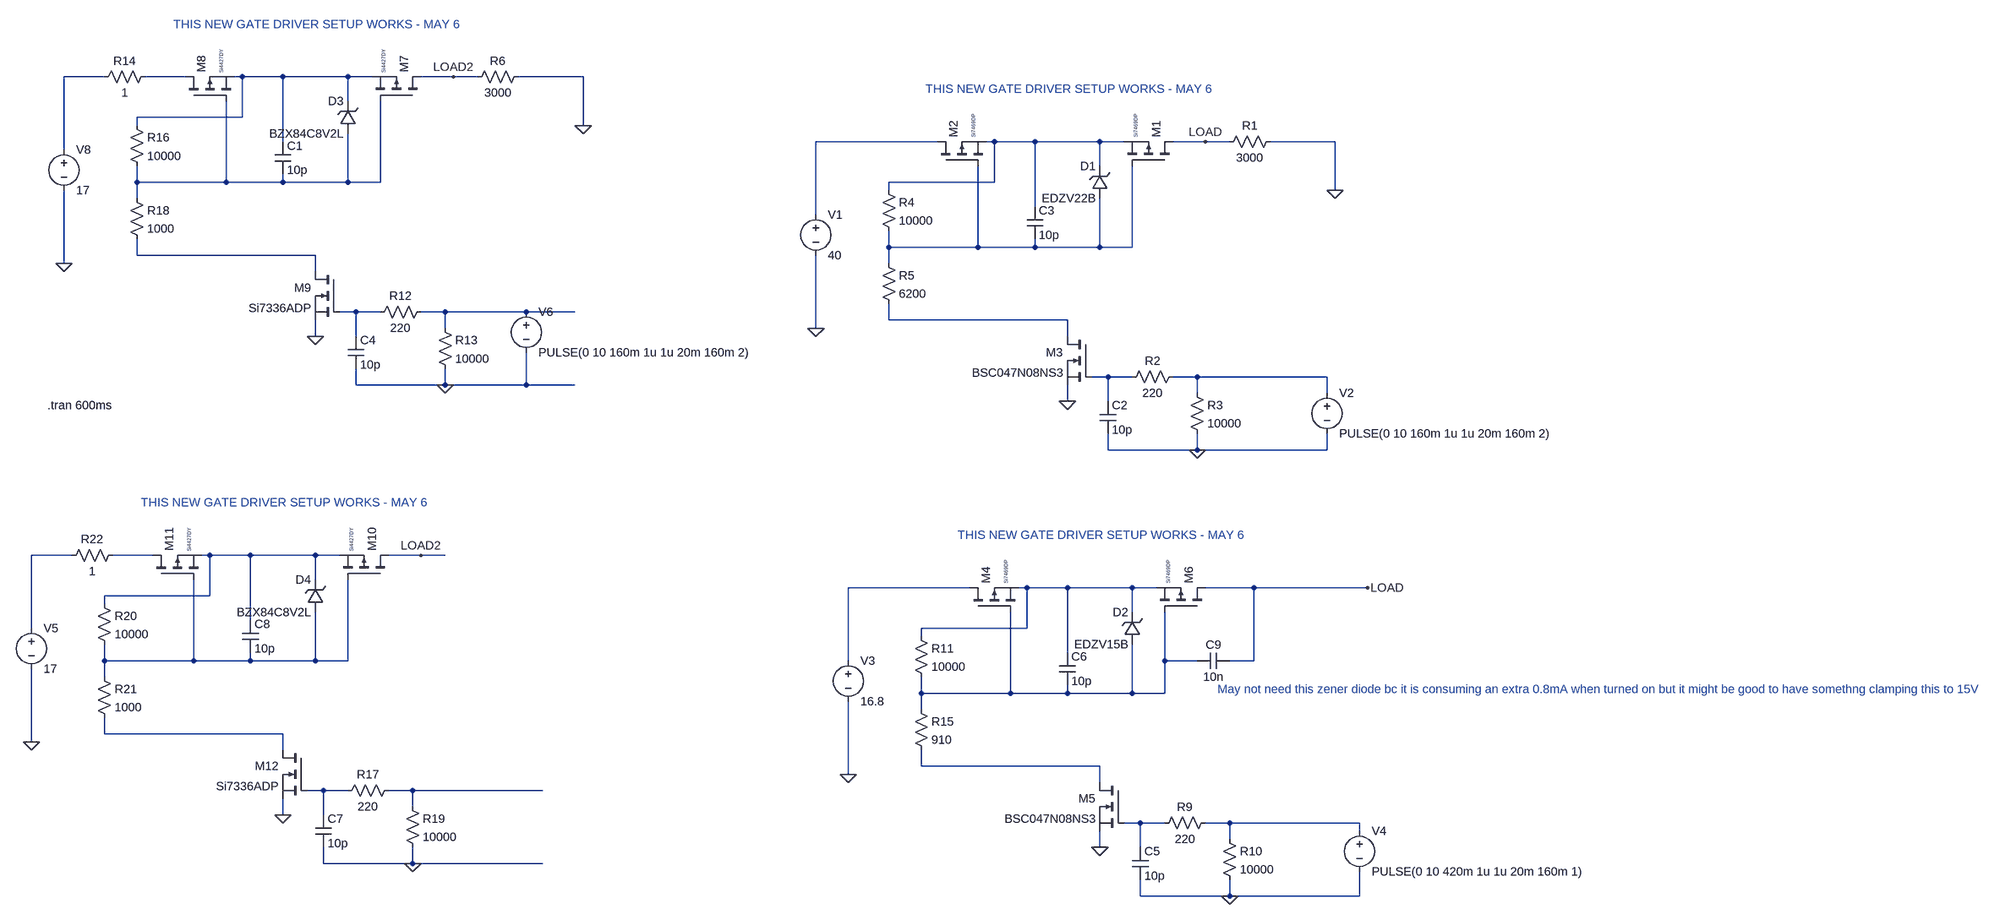
[diagram p0: schematic PMOS Bidirectional Switch.asc]
PMOS Bidirectional Switch.asc, the LTspice schematic file:
Version 4.1
SHEET 1 3412 2516
WIRE -672 256 -752 256
WIRE -512 256 -592 256
WIRE -400 256 -416 256
WIRE -320 256 -400 256
WIRE -192 256 -320 256
WIRE -144 256 -192 256
WIRE 16 256 -48 256
WIRE 64 256 16 256
WIRE 272 256 144 256
WIRE -192 304 -192 256
WIRE -400 336 -400 256
WIRE -400 336 -608 336
WIRE -608 352 -608 336
WIRE 272 352 272 256
WIRE -320 384 -320 256
WIRE 1216 384 976 384
WIRE 1328 384 1312 384
WIRE 1408 384 1328 384
WIRE 1536 384 1408 384
WIRE 1584 384 1536 384
WIRE 1744 384 1680 384
WIRE 1792 384 1744 384
WIRE 2000 384 1872 384
WIRE -752 400 -752 256
WIRE 1536 432 1536 384
WIRE -608 464 -608 432
WIRE -432 464 -432 304
WIRE -432 464 -608 464
WIRE -320 464 -320 448
WIRE -320 464 -432 464
WIRE -192 464 -192 368
WIRE -192 464 -320 464
WIRE -128 464 -128 304
WIRE -128 464 -192 464
WIRE 1328 464 1328 384
WIRE 1328 464 1120 464
WIRE 1120 480 1120 464
WIRE 2000 480 2000 384
WIRE -608 496 -608 464
WIRE 1408 512 1408 384
WIRE 976 528 976 384
WIRE 1120 592 1120 560
WIRE 1296 592 1296 432
WIRE 1296 592 1120 592
WIRE 1408 592 1408 576
WIRE 1408 592 1296 592
WIRE 1536 592 1536 496
WIRE 1536 592 1408 592
WIRE 1600 592 1600 432
WIRE 1600 592 1536 592
WIRE -608 608 -608 576
WIRE -256 608 -608 608
WIRE -752 624 -752 480
WIRE 1120 624 1120 592
WIRE -256 640 -256 608
WIRE -176 720 -208 720
WIRE -128 720 -176 720
WIRE 0 720 -48 720
WIRE 160 720 0 720
WIRE 256 720 160 720
WIRE 1120 736 1120 704
WIRE 1472 736 1120 736
WIRE 0 752 0 720
WIRE 976 752 976 608
WIRE -256 768 -256 736
WIRE -176 768 -176 720
WIRE 1472 768 1472 736
WIRE 1552 848 1520 848
WIRE 1600 848 1552 848
WIRE 1728 848 1680 848
WIRE 1984 848 1728 848
WIRE -176 864 -176 832
WIRE 0 864 0 832
WIRE 0 864 -176 864
WIRE 160 864 160 800
WIRE 160 864 0 864
WIRE 256 864 160 864
WIRE 1728 880 1728 848
WIRE 1984 880 1984 848
WIRE 1472 896 1472 864
WIRE 1552 896 1552 848
WIRE 1552 992 1552 960
WIRE 1728 992 1728 960
WIRE 1728 992 1552 992
WIRE 1984 992 1984 960
WIRE 1984 992 1728 992
WIRE -736 1200 -816 1200
WIRE -576 1200 -656 1200
WIRE -464 1200 -480 1200
WIRE -384 1200 -464 1200
WIRE -256 1200 -384 1200
WIRE -208 1200 -256 1200
WIRE -48 1200 -112 1200
WIRE 0 1200 -48 1200
WIRE -256 1248 -256 1200
WIRE 1280 1264 1040 1264
WIRE 1392 1264 1376 1264
WIRE 1472 1264 1392 1264
WIRE 1600 1264 1472 1264
WIRE 1648 1264 1600 1264
WIRE 1840 1264 1744 1264
WIRE 2064 1264 1840 1264
WIRE -464 1280 -464 1200
WIRE -464 1280 -672 1280
WIRE -672 1296 -672 1280
WIRE 1600 1312 1600 1264
WIRE -384 1328 -384 1200
WIRE -816 1344 -816 1200
WIRE 1392 1344 1392 1264
WIRE 1392 1344 1184 1344
WIRE 1184 1360 1184 1344
WIRE 1472 1392 1472 1264
WIRE -672 1408 -672 1376
WIRE -496 1408 -496 1248
WIRE -496 1408 -672 1408
WIRE -384 1408 -384 1392
WIRE -384 1408 -496 1408
WIRE -256 1408 -256 1312
WIRE -256 1408 -384 1408
WIRE -192 1408 -192 1248
WIRE -192 1408 -256 1408
WIRE 1040 1408 1040 1264
WIRE 1664 1408 1664 1312
WIRE 1728 1408 1664 1408
WIRE 1840 1408 1840 1264
WIRE 1840 1408 1792 1408
WIRE -672 1440 -672 1408
WIRE 1184 1472 1184 1440
WIRE 1360 1472 1360 1312
WIRE 1360 1472 1184 1472
WIRE 1472 1472 1472 1456
WIRE 1472 1472 1360 1472
WIRE 1600 1472 1600 1376
WIRE 1600 1472 1472 1472
WIRE 1664 1472 1664 1408
WIRE 1664 1472 1600 1472
WIRE 1184 1504 1184 1472
WIRE -672 1552 -672 1520
WIRE -320 1552 -672 1552
WIRE -816 1568 -816 1424
WIRE -320 1584 -320 1552
WIRE 1184 1616 1184 1584
WIRE 1536 1616 1184 1616
WIRE 1040 1632 1040 1488
WIRE 1536 1648 1536 1616
WIRE -240 1664 -272 1664
WIRE -192 1664 -240 1664
WIRE -64 1664 -112 1664
WIRE 192 1664 -64 1664
WIRE -64 1696 -64 1664
WIRE -320 1712 -320 1680
WIRE -240 1712 -240 1664
WIRE 1616 1728 1584 1728
WIRE 1664 1728 1616 1728
WIRE 1792 1728 1744 1728
WIRE 2048 1728 1792 1728
WIRE 2048 1744 2048 1728
WIRE 1792 1760 1792 1728
WIRE 1536 1776 1536 1744
WIRE 1616 1776 1616 1728
WIRE -240 1808 -240 1776
WIRE -64 1808 -64 1776
WIRE -64 1808 -240 1808
WIRE 192 1808 -64 1808
WIRE 1616 1872 1616 1840
WIRE 1792 1872 1792 1840
WIRE 1792 1872 1616 1872
WIRE 2048 1872 2048 1824
WIRE 2048 1872 1792 1872
FLAG 272 352 0
FLAG -752 624 0
FLAG -256 768 0
FLAG 0 864 0
FLAG 2000 480 0
FLAG 976 752 0
FLAG 1472 896 0
FLAG 1728 992 0
FLAG 1040 1632 0
FLAG 1536 1776 0
FLAG 1792 1872 0
FLAG 1744 384 LOAD
FLAG 2064 1264 LOAD
FLAG 16 256 LOAD2
FLAG -816 1568 0
FLAG -320 1712 0
FLAG -64 1808 0
FLAG -48 1200 LOAD2
SYMBOL pmos -48 304 M270
WINDOW 3 56 72 Left 0
SYMATTR Value Si4427DY
SYMATTR InstName M7
SYMBOL pmos -512 304 R270
WINDOW 3 56 72 Left 0
SYMATTR Value Si4427DY
SYMATTR InstName M8
SYMBOL res 160 240 R90
WINDOW 0 0 56 VBottom 2
WINDOW 3 32 56 VTop 2
SYMATTR InstName R6
SYMATTR Value 3000
SYMBOL voltage -752 384 R0
WINDOW 123 0 0 Left 0
WINDOW 39 24 124 Left 2
SYMATTR InstName V8
SYMATTR Value 17
SYMBOL nmos -208 640 M0
SYMATTR InstName M9
SYMATTR Value Si7336ADP
SYMBOL res -32 704 R90
WINDOW 0 0 56 VBottom 2
WINDOW 3 32 56 VTop 2
SYMATTR InstName R12
SYMATTR Value 220
SYMBOL res -16 736 R0
SYMATTR InstName R13
SYMATTR Value 10000
SYMBOL cap -192 768 R0
SYMATTR InstName C4
SYMATTR Value 10p
SYMBOL res -624 336 R0
SYMATTR InstName R16
SYMATTR Value 10000
SYMBOL res -624 480 R0
SYMATTR InstName R18
SYMATTR Value 1000
SYMBOL zener -176 368 R180
WINDOW 0 24 64 Left 2
WINDOW 3 24 0 Left 2
SYMATTR InstName D3
SYMATTR Value BZX84C8V2L
SYMBOL res -576 240 R90
WINDOW 0 0 56 VBottom 2
WINDOW 3 32 56 VTop 2
SYMATTR InstName R14
SYMATTR Value 1
SYMBOL cap -336 384 R0
SYMATTR InstName C1
SYMATTR Value 10p
SYMBOL res 1888 368 R90
WINDOW 0 0 56 VBottom 2
WINDOW 3 32 56 VTop 2
SYMATTR InstName R1
SYMATTR Value 3000
SYMBOL voltage 976 512 R0
WINDOW 123 0 0 Left 0
WINDOW 39 24 124 Left 2
SYMATTR InstName V1
SYMATTR Value 40
SYMBOL nmos 1520 768 M0
SYMATTR InstName M3
SYMATTR Value BSC047N08NS3
SYMBOL voltage 1984 864 R0
WINDOW 123 0 0 Left 0
WINDOW 39 0 0 Left 0
SYMATTR InstName V2
SYMATTR Value PULSE(0 10 160m 1u 1u 20m 160m 2)
SYMBOL res 1696 832 R90
WINDOW 0 0 56 VBottom 2
WINDOW 3 32 56 VTop 2
SYMATTR InstName R2
SYMATTR Value 220
SYMBOL res 1712 864 R0
SYMATTR InstName R3
SYMATTR Value 10000
SYMBOL cap 1536 896 R0
SYMATTR InstName C2
SYMATTR Value 10p
SYMBOL res 1104 464 R0
SYMATTR InstName R4
SYMATTR Value 10000
SYMBOL res 1104 608 R0
SYMATTR InstName R5
SYMATTR Value 6200
SYMBOL cap 1392 512 R0
SYMATTR InstName C3
SYMATTR Value 10p
SYMBOL zener 1552 496 R180
WINDOW 0 24 64 Left 2
WINDOW 3 24 0 Left 2
SYMATTR InstName D1
SYMATTR Value EDZV22B
SYMBOL voltage 1040 1392 R0
WINDOW 123 0 0 Left 0
WINDOW 39 24 124 Left 2
SYMATTR InstName V3
SYMATTR Value 16.8
SYMBOL nmos 1584 1648 M0
SYMATTR InstName M5
SYMATTR Value BSC047N08NS3
SYMBOL res 1760 1712 R90
WINDOW 0 0 56 VBottom 2
WINDOW 3 32 56 VTop 2
SYMATTR InstName R9
SYMATTR Value 220
SYMBOL res 1776 1744 R0
SYMATTR InstName R10
SYMATTR Value 10000
SYMBOL cap 1600 1776 R0
SYMATTR InstName C5
SYMATTR Value 10p
SYMBOL res 1168 1344 R0
SYMATTR InstName R11
SYMATTR Value 10000
SYMBOL res 1168 1488 R0
SYMATTR InstName R15
SYMATTR Value 910
SYMBOL cap 1456 1392 R0
SYMATTR InstName C6
SYMATTR Value 10p
SYMBOL pmos 1744 1312 M270
WINDOW 3 56 72 Left 0
SYMATTR Value Si7469DP
SYMATTR InstName M6
SYMBOL zener 1616 1376 R180
WINDOW 0 24 64 Left 2
WINDOW 3 24 0 Left 2
SYMATTR InstName D2
SYMATTR Value EDZV15B
SYMBOL pmos 1280 1312 R270
WINDOW 3 56 72 Left 0
SYMATTR Value Si7469DP
SYMATTR InstName M4
SYMBOL pmos 1680 432 M270
WINDOW 3 56 72 Left 0
SYMATTR Value Si7469DP
SYMATTR InstName M1
SYMBOL pmos 1216 432 R270
WINDOW 3 56 72 Left 0
SYMATTR Value Si7469DP
SYMATTR InstName M2
SYMBOL voltage 2048 1728 R0
WINDOW 123 0 0 Left 0
WINDOW 39 0 0 Left 0
SYMATTR InstName V4
SYMATTR Value PULSE(0 10 420m 1u 1u 20m 160m 1)
SYMBOL pmos -112 1248 M270
WINDOW 3 56 72 Left 0
SYMATTR Value Si4427DY
SYMATTR InstName M10
SYMBOL pmos -576 1248 R270
WINDOW 3 56 72 Left 0
SYMATTR Value Si4427DY
SYMATTR InstName M11
SYMBOL voltage -816 1328 R0
WINDOW 123 0 0 Left 0
WINDOW 39 24 124 Left 2
SYMATTR InstName V5
SYMATTR Value 17
SYMBOL nmos -272 1584 M0
SYMATTR InstName M12
SYMATTR Value Si7336ADP
SYMBOL res -96 1648 R90
WINDOW 0 0 56 VBottom 2
WINDOW 3 32 56 VTop 2
SYMATTR InstName R17
SYMATTR Value 220
SYMBOL res -80 1680 R0
SYMATTR InstName R19
SYMATTR Value 10000
SYMBOL cap -256 1712 R0
SYMATTR InstName C7
SYMATTR Value 10p
SYMBOL res -688 1280 R0
SYMATTR InstName R20
SYMATTR Value 10000
SYMBOL res -688 1424 R0
SYMATTR InstName R21
SYMATTR Value 1000
SYMBOL zener -240 1312 R180
WINDOW 0 24 64 Left 2
WINDOW 3 24 0 Left 2
SYMATTR InstName D4
SYMATTR Value BZX84C8V2L
SYMBOL res -640 1184 R90
WINDOW 0 0 56 VBottom 2
WINDOW 3 32 56 VTop 2
SYMATTR InstName R22
SYMATTR Value 1
SYMBOL cap -400 1328 R0
SYMATTR InstName C8
SYMATTR Value 10p
SYMBOL voltage 160 704 R0
WINDOW 123 0 0 Left 0
WINDOW 39 0 0 Left 0
SYMATTR InstName V6
SYMATTR Value PULSE(0 10 160m 1u 1u 20m 160m 2)
SYMBOL cap 1792 1392 R90
WINDOW 0 0 32 VBottom 2
WINDOW 3 32 32 VTop 2
SYMATTR InstName C9
SYMATTR Value 10n
TEXT -536 152 Left 2 ;THIS NEW GATE DRIVER SETUP WORKS - MAY 6
TEXT -784 904 Left 2 !.tran 600ms
TEXT 1192 280 Left 2 ;THIS NEW GATE DRIVER SETUP WORKS - MAY 6
TEXT 1256 1160 Left 2 ;THIS NEW GATE DRIVER SETUP WORKS - MAY 6
TEXT 1768 1464 Left 2 ;May not need this zener diode bc it is consuming an extra 0.8mA when turned on but it might be good to have somethng clamping this to 15V
TEXT -600 1096 Left 2 ;THIS NEW GATE DRIVER SETUP WORKS - MAY 6

The netlist it stands for:
* PMOS Bidirectional Switch.asc
M7 LOAD2 N006 N003 N003 Si4427DY
M8 N002 N006 N003 N003 Si4427DY
R6 0 LOAD2 3000
V8 N001 0 17
M9 N008 N009 0 0 Si7336ADP
R12 N010 N009 220
R13 N010 0 10000
C4 N009 0 10p
R16 N003 N006 10000
R18 N006 N008 1000
D3 N006 N003 BZX84C8V2L
R14 N002 N001 1
C1 N003 N006 10p
R1 0 LOAD 3000
V1 N004 0 40
M3 N011 N012 0 0 BSC047N08NS3
V2 N013 0 PULSE(0 10 160m 1u 1u 20m 160m 2)
R2 N013 N012 220
R3 N013 0 10000
C2 N012 0 10p
R4 N005 N007 10000
R5 N007 N011 6200
C3 N005 N007 10p
D1 N007 N005 EDZV22B
V3 N017 0 16.8
M5 N022 N025 0 0 BSC047N08NS3
R9 N026 N025 220
R10 N026 0 10000
C5 N025 0 10p
R11 N018 N020 10000
R15 N020 N022 910
C6 N018 N020 10p
M6 LOAD N020 N018 N018 Si7469DP
D2 N020 N018 EDZV15B
M4 N017 N020 N018 N018 Si7469DP
M1 LOAD N007 N005 N005 Si7469DP
M2 N004 N007 N005 N005 Si7469DP
V4 N026 0 PULSE(0 10 420m 1u 1u 20m 160m 1)
M10 LOAD2 N019 N016 N016 Si4427DY
M11 N015 N019 N016 N016 Si4427DY
V5 N014 0 17
M12 N021 N023 0 0 Si7336ADP
R17 N024 N023 220
R19 N024 0 10000
C7 N023 0 10p
R20 N016 N019 10000
R21 N019 N021 1000
D4 N019 N016 BZX84C8V2L
R22 N015 N014 1
C8 N016 N019 10p
V6 N010 0 PULSE(0 10 160m 1u 1u 20m 160m 2)
C9 LOAD N020 10n
.model D D
.lib standard.dio
.model NMOS NMOS
.model PMOS PMOS
.lib standard.mos
* THIS NEW GATE DRIVER SETUP WORKS - MAY 6
.tran 600ms
* THIS NEW GATE DRIVER SETUP WORKS - MAY 6
* THIS NEW GATE DRIVER SETUP WORKS - MAY 6
* May not need this zener diode bc it is consuming an extra 0.8mA when turned on but it might be good to have somethng clamping this to 15V
* THIS NEW GATE DRIVER SETUP WORKS - MAY 6
.backanno
.end